# Altium schematic sheet AudioOutputs_16.SchDoc
size Tabloid; Size: 11x17; Sheet_Name: AudioOutputs_16
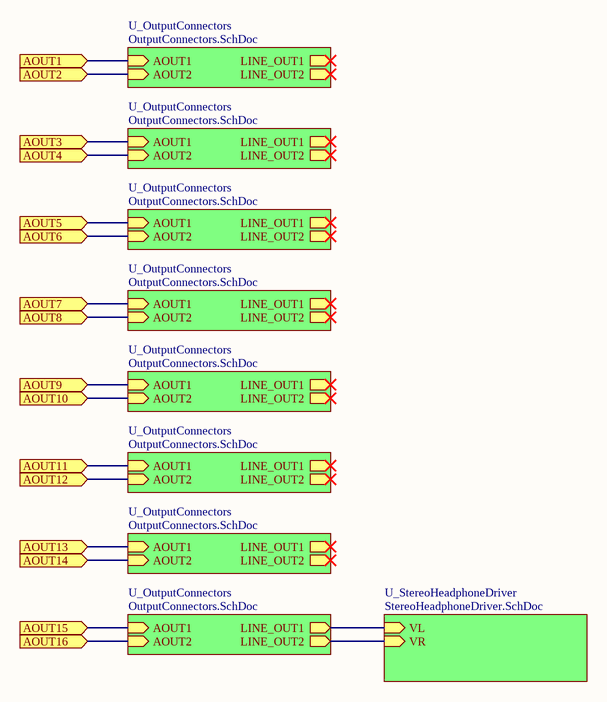
[diagram p0: AudioOutputs_16.SchDoc]

## Sub-sheets
U_OutputConnectors = OutputConnectors.SchDoc: AOUT1 (in), AOUT2 (in), LINE_OUT1 (out), LINE_OUT2 (out)
U_OutputConnectors = OutputConnectors.SchDoc: AOUT1 (in), AOUT2 (in), LINE_OUT1 (out), LINE_OUT2 (out)
U_OutputConnectors = OutputConnectors.SchDoc: AOUT1 (in), AOUT2 (in), LINE_OUT1 (out), LINE_OUT2 (out)
U_OutputConnectors = OutputConnectors.SchDoc: AOUT1 (in), AOUT2 (in), LINE_OUT1 (out), LINE_OUT2 (out)
U_OutputConnectors = OutputConnectors.SchDoc: AOUT1 (in), AOUT2 (in), LINE_OUT1 (out), LINE_OUT2 (out)
U_OutputConnectors = OutputConnectors.SchDoc: AOUT1 (in), AOUT2 (in), LINE_OUT1 (out), LINE_OUT2 (out)
U_OutputConnectors = OutputConnectors.SchDoc: AOUT1 (in), AOUT2 (in), LINE_OUT1 (out), LINE_OUT2 (out)
U_OutputConnectors = OutputConnectors.SchDoc: AOUT1 (in), AOUT2 (in), LINE_OUT1 (out), LINE_OUT2 (out)
U_StereoHeadphoneDriver = StereoHeadphoneDriver.SchDoc: VL (in), VR (in)

## Ports
AOUT1 (in), AOUT2 (in), AOUT3 (in), AOUT4 (in), AOUT5 (in), AOUT6 (in), AOUT7 (in), AOUT8 (in), AOUT9 (in), AOUT10 (in), AOUT11 (in), AOUT12 (in), AOUT13 (in), AOUT14 (in), AOUT15 (in), AOUT16 (in)

## Nets
AOUT1: port AOUT1, sheet U_OutputConnectors/AOUT1
AOUT2: port AOUT2, sheet U_OutputConnectors/AOUT2
AOUT3: port AOUT3, sheet U_OutputConnectors/AOUT1
AOUT4: port AOUT4, sheet U_OutputConnectors/AOUT2
AOUT5: port AOUT5, sheet U_OutputConnectors/AOUT1
AOUT6: port AOUT6, sheet U_OutputConnectors/AOUT2
AOUT7: port AOUT7, sheet U_OutputConnectors/AOUT1
AOUT8: port AOUT8, sheet U_OutputConnectors/AOUT2
AOUT9: port AOUT9, sheet U_OutputConnectors/AOUT1
AOUT10: port AOUT10, sheet U_OutputConnectors/AOUT2
AOUT11: port AOUT11, sheet U_OutputConnectors/AOUT1
AOUT12: port AOUT12, sheet U_OutputConnectors/AOUT2
AOUT13: port AOUT13, sheet U_OutputConnectors/AOUT1
AOUT14: port AOUT14, sheet U_OutputConnectors/AOUT2
AOUT15: port AOUT15, sheet U_OutputConnectors/AOUT1
AOUT16: port AOUT16, sheet U_OutputConnectors/AOUT2
(unnamed): sheet U_OutputConnectors/LINE_OUT1, sheet U_StereoHeadphoneDriver/VL
(unnamed): sheet U_OutputConnectors/LINE_OUT2, sheet U_StereoHeadphoneDriver/VR

## Notes on the sheet
- Sheet Name
- Project Title
- Size
- Group
- Revision
- Date :
- Filename :
- Sheet
- Authors :
- of